# EAGLE schematic schematic (EAGLE 6.4)
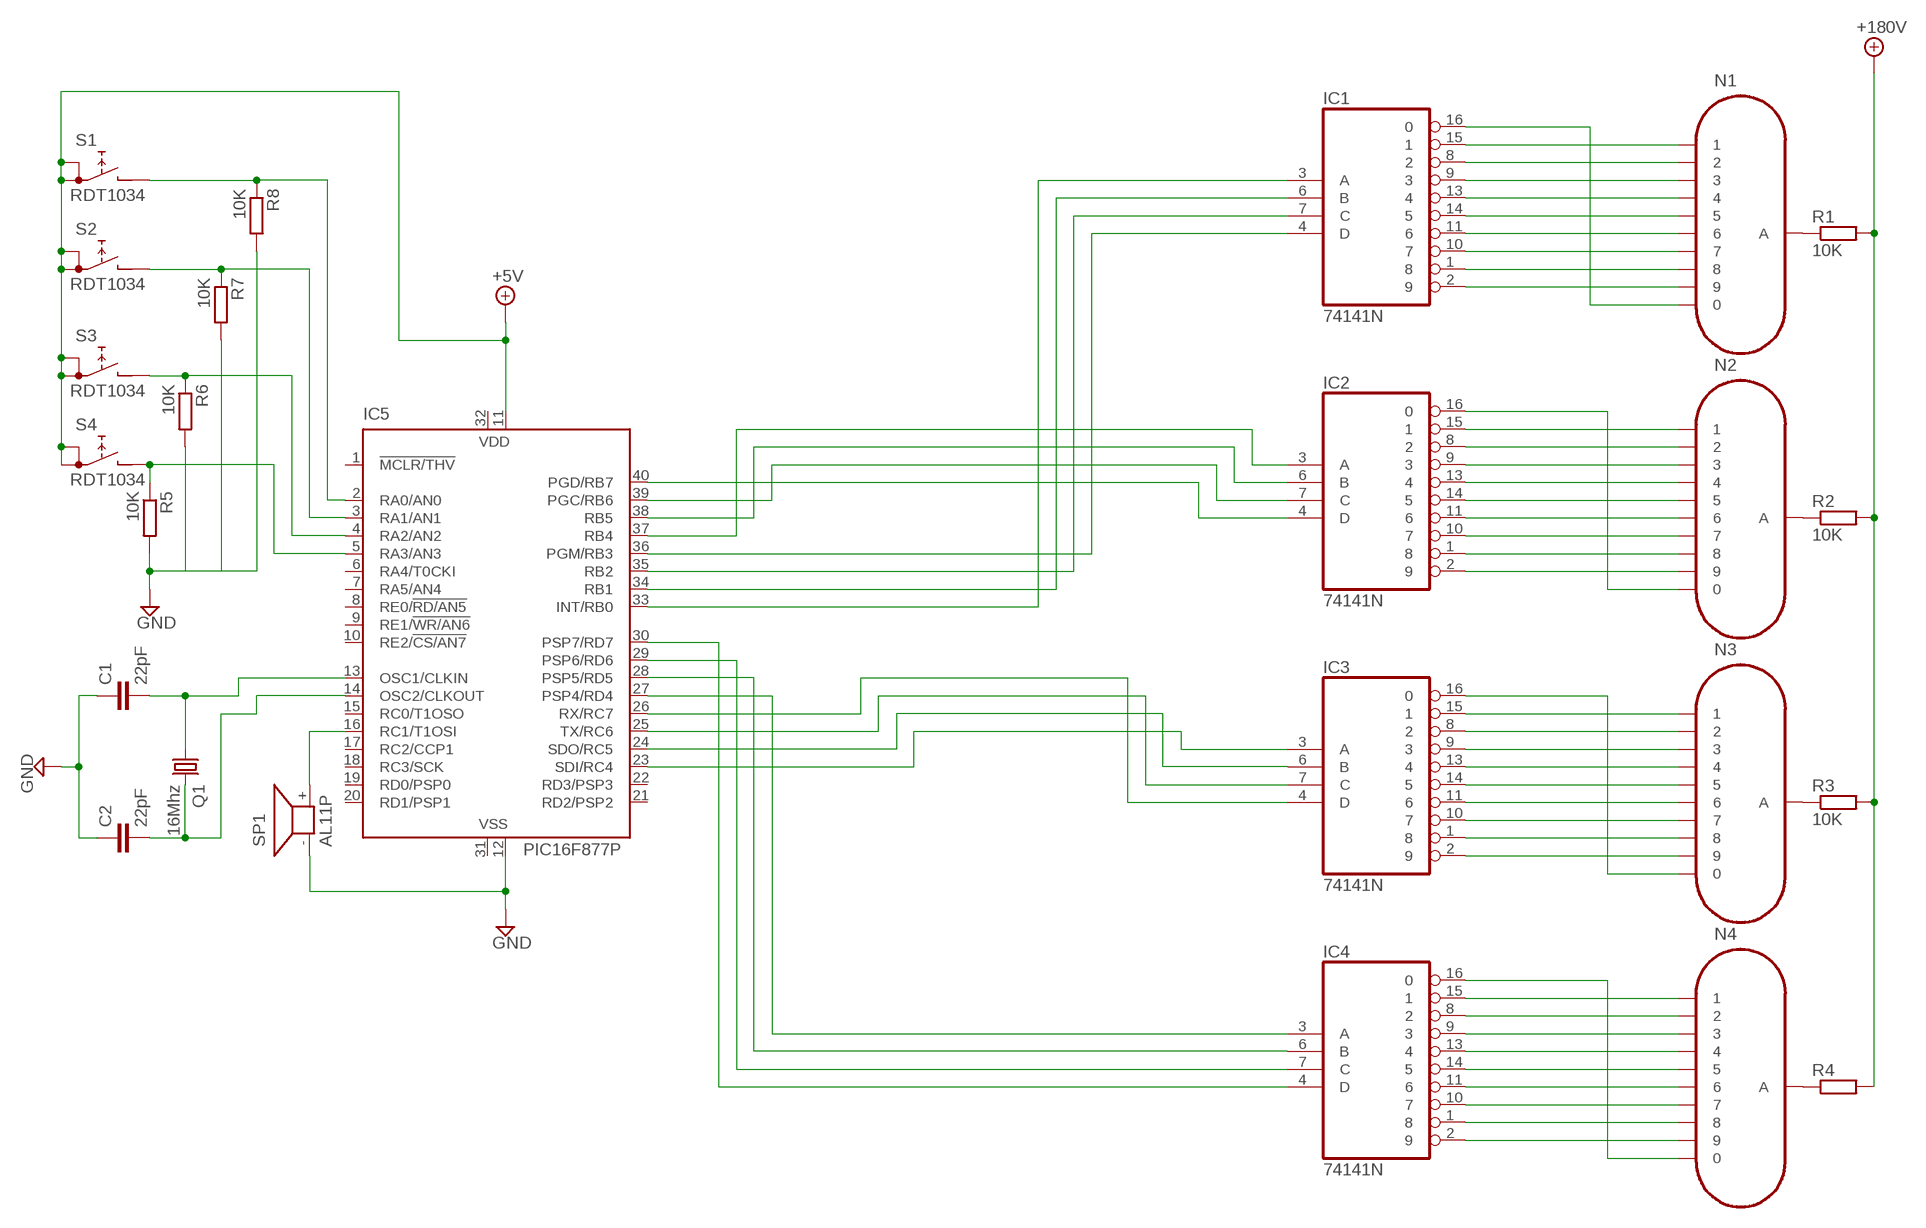
[diagram p0: schematic, sheet 1]

## Parts
C1  22pF  C5/2.5  [C5B2.5]
C2  22pF  C5/2.5  [C5B2.5]
IC1  74141N  [DIL16]
IC2  74141N  [DIL16]
IC3  74141N  [DIL16]
IC4  74141N  [DIL16]
IC5  PIC16F877P  [DIL40]
N1  IN-8  [IN-8]
N2  IN-8  [IN-8]
N3  IN-8  [IN-8]
N4  IN-8  [IN-8]
Q1  16Mhz  CRYSTALHC49S  [HC49/S]
R1  10K  R-EU_0204/7  [0204/7]
R2  10K  R-EU_0204/7  [0204/7]
R3  10K  R-EU_0204/7  [0204/7]
R4  R-EU_0204/7  [0204/7]
R5  10K  R-EU_0204/5  [0204/5]
R6  10K  R-EU_0204/5  [0204/5]
R7  10K  R-EU_0204/5  [0204/5]
R8  10K  R-EU_0204/5  [0204/5]
S1  RDT1034  [RDT1034]
S2  RDT1034  [RDT1034]
S3  RDT1034  [RDT1034]
S4  RDT1034  [RDT1034]
SP1  AL11P  [AL11P]

## Nets
+5V: IC5.11(VDD) S1.A S1.A1 S2.A S2.A1 S3.A S3.A1 S4.A S4.A1
+24V: R1.2 R2.2 R3.2 R4.2 ; supply symbol labelled +180V
GND: C1.1 C2.1 IC5.12(VSS) R5.2 R6.2 R7.2 R8.2 SP1.-
N$1: IC1.16 N1.0
N$2: IC1.15 N1.1
N$3: IC1.8 N1.2
N$4: IC1.9 N1.3
N$5: IC1.14 N1.5
N$6: IC1.13 N1.4
N$7: IC1.11 N1.6
N$8: IC1.10 N1.7
N$9: IC1.1 N1.8
N$10: IC1.2 N1.9
N$11: IC2.16 N2.0
N$12: IC2.15 N2.1
N$13: IC2.8 N2.2
N$14: IC2.9 N2.3
N$15: IC2.13 N2.4
N$16: IC2.14 N2.5
N$17: IC2.11 N2.6
N$18: IC2.10 N2.7
N$19: IC2.1 N2.8
N$20: IC2.2 N2.9
N$21: IC3.16 N3.0
N$22: IC3.15 N3.1
N$23: IC3.8 N3.2
N$24: IC3.9 N3.3
N$25: IC3.13 N3.4
N$26: IC3.14 N3.5
N$27: IC3.11 N3.6
N$28: IC3.10 N3.7
N$29: IC3.1 N3.8
N$30: IC3.2 N3.9
N$31: IC4.16 N4.0
N$32: IC4.15 N4.1
N$33: IC4.8 N4.2
N$34: IC4.9 N4.3
N$35: IC4.13 N4.4
N$36: IC4.14 N4.5
N$37: IC4.11 N4.6
N$38: IC4.10 N4.7
N$39: IC4.1 N4.8
N$40: IC4.2 N4.9
N$41: IC1.3(A) IC5.33(INT/RB0)
N$42: IC1.6(B) IC5.34(RB1)
N$43: IC1.7(C) IC5.35(RB2)
N$44: IC1.4(D) IC5.36(PGM/RB3)
N$45: IC2.3(A) IC5.37(RB4)
N$46: IC2.6(B) IC5.38(RB5)
N$47: IC2.7(C) IC5.39(PGC/RB6)
N$48: IC2.4(D) IC5.40(PGD/RB7)
N$49: IC3.4(D) IC5.26(RX/RC7)
N$50: IC3.7(C) IC5.25(TX/RC6)
N$51: IC3.6(B) IC5.24(SDO/RC5)
N$52: IC3.3(A) IC5.23(SDI/RC4)
N$53: IC4.3(A) IC5.27(PSP4/RD4)
N$54: IC4.6(B) IC5.28(PSP5/RD5)
N$55: IC4.7(C) IC5.29(PSP6/RD6)
N$56: IC4.4(D) IC5.30(PSP7/RD7)
N$57: N1.A R1.1
N$58: N2.A R2.1
N$59: N3.A R3.1
N$60: N4.A R4.1
N$61: IC5.16(RC1/T1OSI) SP1.+
N$62: IC5.5(RA3/AN3) R5.1 S4.B
N$63: IC5.4(RA2/AN2) R6.1 S3.B
N$64: IC5.3(RA1/AN1) R7.1 S2.B
N$65: IC5.2(RA0/AN0) R8.1 S1.B
N$67: C1.2 IC5.13(OSC1/CLKIN) Q1.1
N$68: C2.2 IC5.14(OSC2/CLKOUT) Q1.2
Unconnected: IC5.1(!MCLR/THV) IC5.6(RA4/T0CKI) IC5.7(RA5/AN4) IC5.8(RE0/!RD/AN5) IC5.9(RE1/!WR/AN6) IC5.10(RE2/!CS/AN7) IC5.15(RC0/T1OSO) IC5.17(RC2/CCP1) IC5.18(RC3/SCK) IC5.19(RD0/PSP0) IC5.20(RD1/PSP1) IC5.21(RD2/PSP2) IC5.22(RD3/PSP3)

## Power pins joined to a net without a drawn wire
GND: IC1.12(GND) IC2.12(GND) IC3.12(GND) IC4.12(GND)
VCC: IC1.5(VCC) IC2.5(VCC) IC3.5(VCC) IC4.5(VCC)
VDD: IC5.32(VDD)
VSS: IC5.31(VSS)

## Library data of the parts
C1 C2 = capacitor-wima:C: CAPACITOR naming: grid - package width
IC1-IC4 = 74xx-eu:74*141: BCD to decimal DECODER/DRIVER
IC5 = microchip:PIC16F87*: MICROCONTROLLER; MF: MICROCHIP; MPN: PIC16F877-04/P; OC_FARNELL: 9761349; OC_NEWARK: 61K3463
N1-N4 = russian-nixies:IN-8: IN-8: medium numeric frontview nixie tube
Q1 = crystal:CRYSTAL: CRYSTAL; OC_FARNELL: 1667008; OC_NEWARK: unknown
R1-R8 = resistor:R-EU_: RESISTOR, European symbol
S1-S4 = switch:RDT1034: PUSH SWITCH www.radiohm.com
SP1 = buzzer:AL11P: SPEAKER Source: Buerklin; OC_FARNELL: unknown; OC_NEWARK: unknown